# EAGLE design test (EAGLE 6.1)
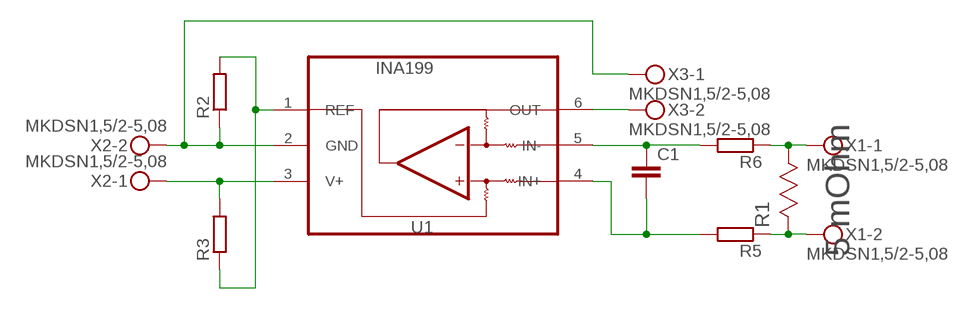
[diagram p0: schematic, sheet 1]

## Parts
C1  C-EUC0805  [C0805]
R1  5 mOhm  ERJ-M1WSF5M0U  [RESC6332X110N]
R2  R-EU_R0805  [R0805]
R3  R-EU_R0805  [R0805]
R5  R-EU_R0805  [R0805]
R6  R-EU_R0805  [R0805]
U1  INA199  [SC70-6L]
X1  MKDSN1,5/2-5,08  [MKDSN1,5/2-5,08]
X2  MKDSN1,5/2-5,08  [MKDSN1,5/2-5,08]
X3  MKDSN1,5/2-5,08  [MKDSN1,5/2-5,08]

## Nets
GND: R2.1 U1.2(GND) X2.2 X3.1
N$1: C1.1 R6.2 U1.5(IN-)
N$2: C1.2 R5.2 U1.4(IN+)
N$3: R2.2 R3.1 U1.1(REF)
N$4: R1.1(R1) R6.1 X1.1
N$5: R1.2(R2) R5.1 X1.2
N$6: U1.6(OUT) X3.2
VCC: R3.2 U1.3(V+) X2.1

## Library data of the parts
C1 = rcl:C-EU: CAPACITOR, European symbol
R1 = panasonic_resistor_current sense:ERJ-M1WSF5M0U: RESISTOR, 2512; MPN: ERJ-M1WSF5M0U; OC_FARNELL: 1577579; OC_NEWARK: 08N2224; SUPPLIER: Panasonic; TOLERANCE: ±1%; WATTAGE: 1W
R2 R3 R5 R6 = rcl:R-EU_: RESISTOR, European symbol
U1 = myHome:INA199
X1-X3 = con-phoenix-508:MKDSN1,5/2-5,08: MKDSN 1,5/ 2-5,08 Printklemme Nennstrom: 13,5 A Nennspannung: 250 V Rastermaß: 5,08 mm Polzahl: 2 Anschlussart: Schraubanschluss Montage: Löten Anschlussrichtung Leiter/Platine: 0 ° Artikelnummer: 1729128 Source: http://eshop.phoenixcontact.com .. 1729128.pdf; MPN: MKDSN 1,5/2-5.08; OC_FARNELL: 1792903; OC_NEWARK: 30M2397

## Board
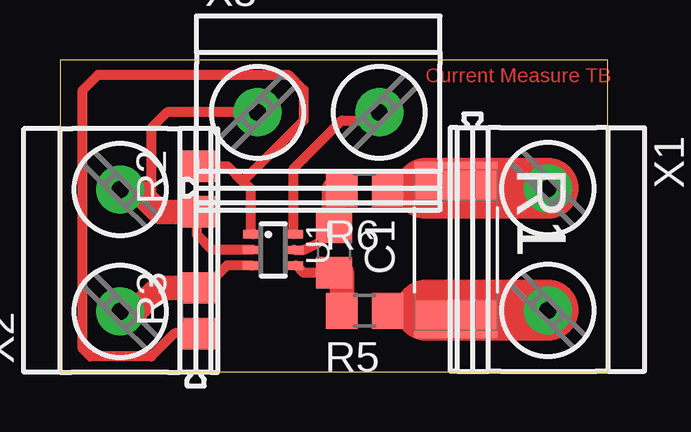
[diagram p1: board, top side]

Size 22.84 x 13.01 mm. Coordinates in mm from the lower left corner, seen from the top.
Outline: 0,0 22.84,0 22.84,13.01 0,13.01 0,0
Copper layers (1*16): Top 0.035mm / dielectric 1.5mm / Bottom 0.035mm
Design rules: minimum track width 10mil, minimum drill 24mil, track to track 8mil, track to pad 8mil, pad to pad 8mil, via to via 8mil, smd to smd 8mil, copper to edge 40mil, drill to drill 8mil, minimum pad ring 10mil, minimum via ring 8mil, stop-mask expansion 4mil, vias tented up to drill 0mil, thermal gap 10mil

### Footprints (pad centres in the part's own frame; a part is rotated, then mirrored left to right if it is on the bottom)
C0805 = smd 1.3 x 1.5: 1 -0.95,0; 2 0.95,0
RESC6332X110N = smd 1.6 x 3.454: 1 -2.87,0; 2 2.87,0
R0805 = smd 1.3 x 1.5: 1 -0.95,0; 2 0.95,0
SC70-6L = smd 0.35 x 0.8: 1 -0.65,-0.85; 2 0,-0.85; 3 0.65,-0.85; 4 0.65,0.85; 5 0,0.865; 6 -0.65,0.85
MKDSN1,5/2-5,08 = drill 0.7 pad 2: 1 -2.561,0.025; 2 2.519,0.025

### Placement (x,y rotation side)
C1  11.43,5.08 270 top
R1  16.51,5.08 270 top
R2  5.71,7.62 90 top
R3  5.71,2.54 90 top
R5  12.7,2.54 180 top
R6  12.7,7.62 180 top
U1  8.89,5.08 270 top
X1  20.32,5.08 270 top
X2  2.54,5.08 90 top
X3  10.79,10.79 0 top

### Tracks (layer width: path | path; a pad name or v marks a point on that pad's centre or on a via)
GND
  Top 0.406: U1.2 6.35,5.08 5.71,5.71 R2.1 | X3.1 4.47,10.82 3.81,10.16 3.81,7.62 3.49,7.3
  Top 1.016: X2.2 3.2,7.6 3.49,7.3 4.13,6.67 R2.1
N$1
  Top 0.406: U1.5 10.16,5.08 10.79,5.4 10.8,5.4 C1.1
  Top 1.016: R6.2 11.43,7.62 11.43,6.35 C1.1
N$2
  Top 0.254: U1.4 9.83,4.43 9.84,4.45
  Top 0.406: C1.2 10.16,4.13 9.84,4.45
  Top 1.016: C1.2 11.75,4.13 R5.2
N$3
  Top 0.406: R2.2 6.99,8.57 7.62,7.94 | 7.62,7.94 7.94,7.62 7.94,5.83 U1.1 | R3.1 4.76,1.59 3.81,0.64 1.27,0.64 0.95,0.95 0.95,11.75 1.59,12.38 9.53,12.38 10.16,11.75 10.16,10.48 7.62,7.94
N$4
  Top 0.406: R6.1 16.51,7.62 R1.1 15.24,7.64
  Top 2.54: X1.1 15.24,7.64
N$5
  Top 0.406: 15.24,2.56 16.51,2.54 | R5.1 16.51,2.54 | 16.51,2.54 R1.2
  Top 2.54: X1.2 15.24,2.56
N$6
  Top 0.406: U1.6 9.74,8.47 10.16,8.89 11.75,10.48 12.97,10.48 X3.2
VCC
  Top 0.406: R3.2 6.03,3.49 6.98,4.45 7.94,4.45 7.95,4.43 U1.3
  Top 1.016: X2.1 3.15,2.52 3.81,3.17 4.13,3.49 R3.2

### Text on the board
Top: Current Measure TB